# EasyEDA schematic SCH_mysplitkeyboard-left(main).json
TITLE: Sheet_1; REV: 1.0; Date: 2022-05-28; Sheet: 1/1; Drawn By: 10yeechern; Company: Your Company
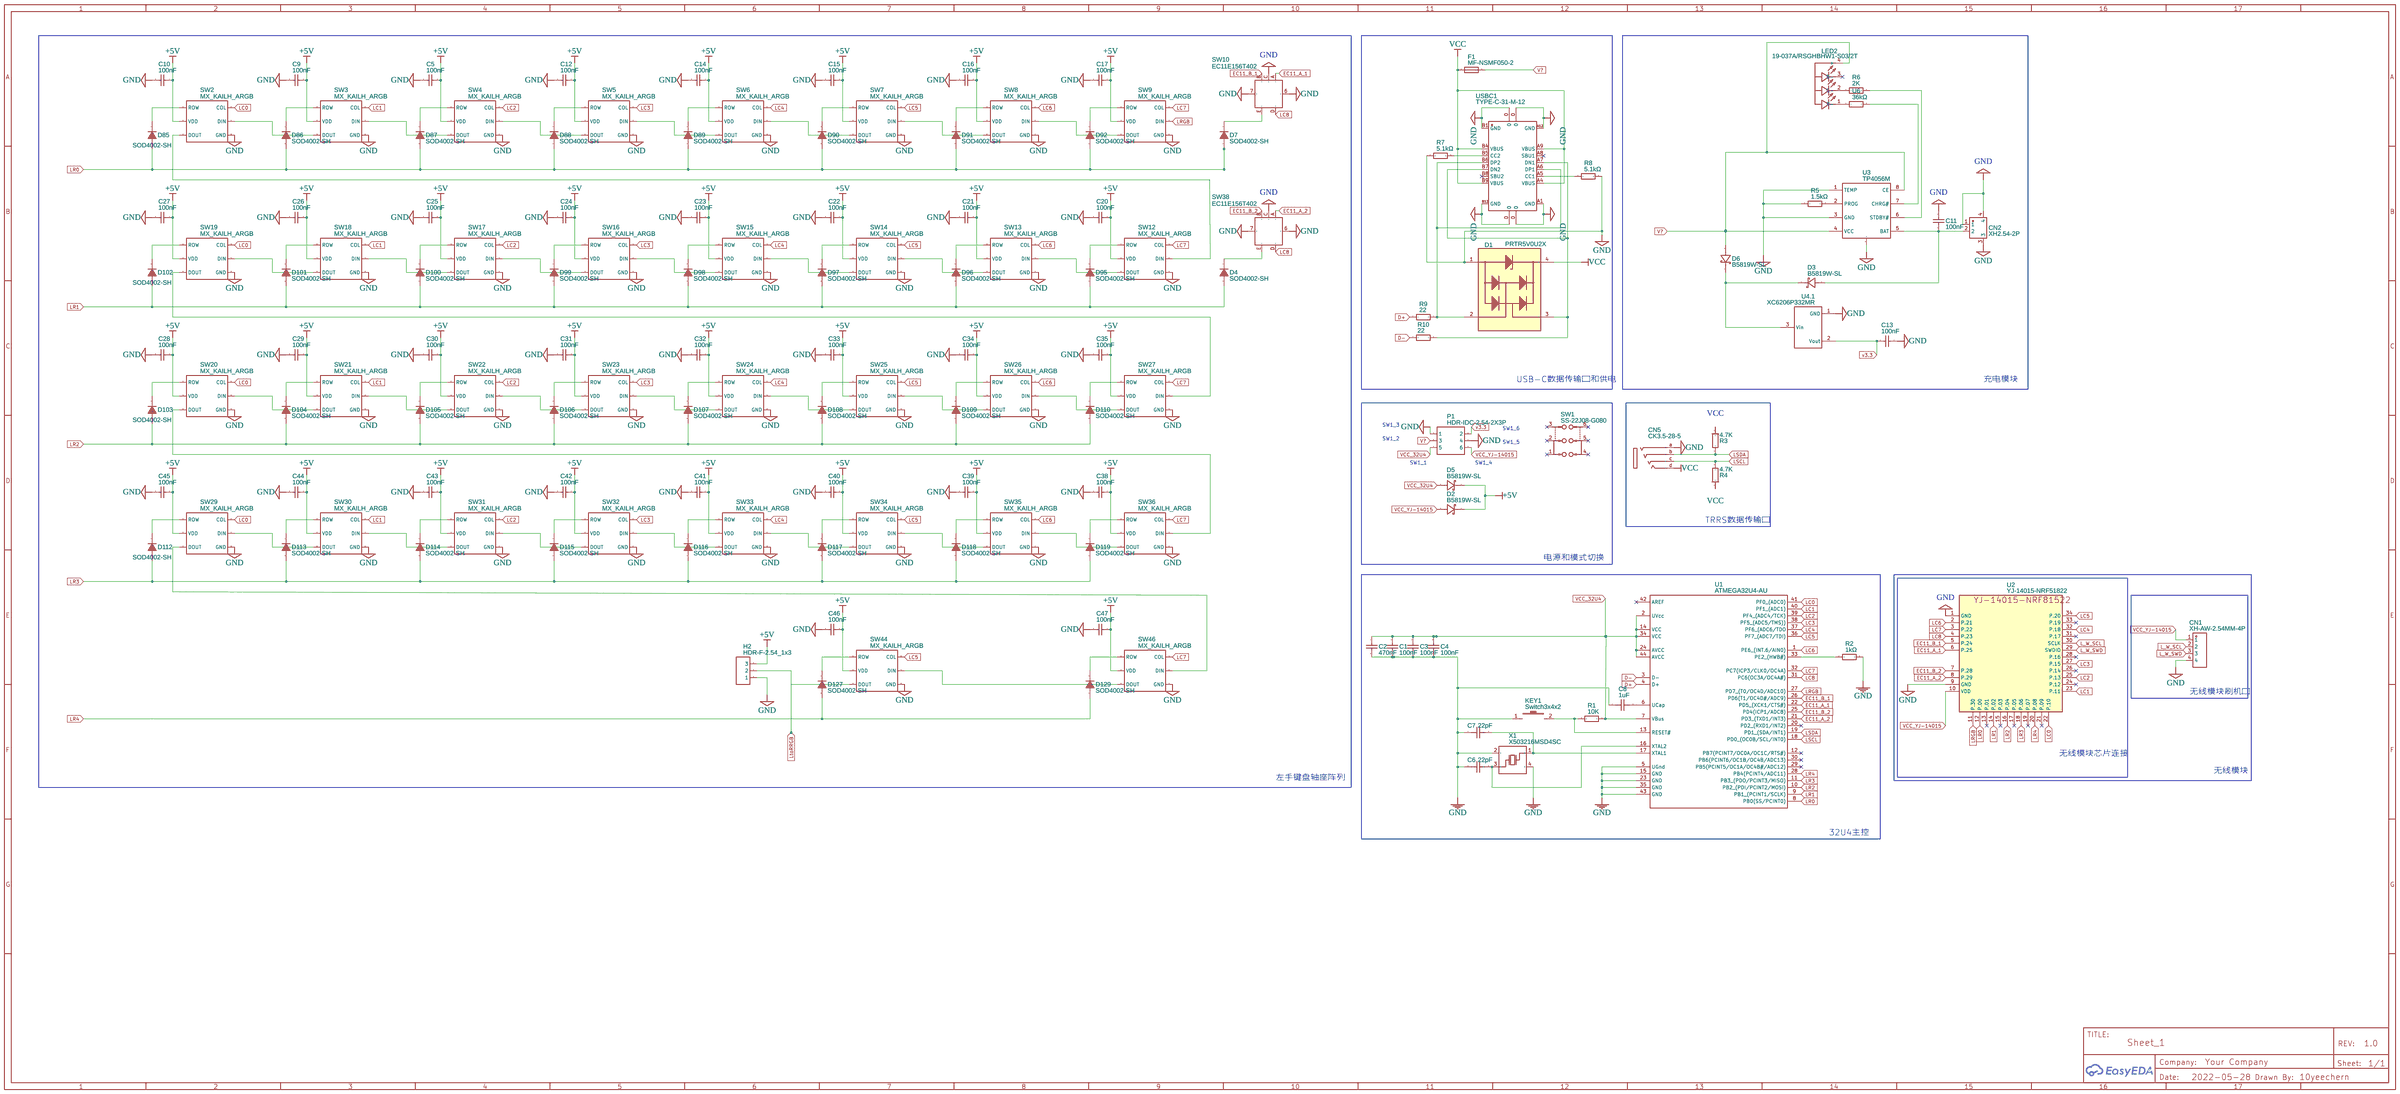
[diagram p0: schematic sheet]

## Parts
C1  100nF  [C0805]
C2  470nF  [C0805]
C3  100nF  [C0805]
C4  100nF  [C0805]
C5  100nF  [C0805]
C6  22pF  [C0805]
C7  22pF  [C0805]
C8  1uF  [C0805]
C9  100nF  [C0805]
C10  100nF  [C0805]
C11  100nF  [C0805]
C12  100nF  [C0805]
C13  100nF  [C0805]
C14  100nF  [C0805]
C15  100nF  [C0805]
C16  100nF  [C0805]
C17  100nF  [C0805]
C20  100nF  [C0805]
C21  100nF  [C0805]
C22  100nF  [C0805]
C23  100nF  [C0805]
C24  100nF  [C0805]
C25  100nF  [C0805]
C26  100nF  [C0805]
C27  100nF  [C0805]
C28  100nF  [C0805]
C29  100nF  [C0805]
C30  100nF  [C0805]
C31  100nF  [C0805]
C32  100nF  [C0805]
C33  100nF  [C0805]
C34  100nF  [C0805]
C35  100nF  [C0805]
C38  100nF  [C0805]
C39  100nF  [C0805]
C40  100nF  [C0805]
C41  100nF  [C0805]
C42  100nF  [C0805]
C43  100nF  [C0805]
C44  100nF  [C0805]
C45  100nF  [C0805]
C46  100nF  [C0805]
C47  100nF  [C0805]
CN1  XH-AW-2.54MM-4P  [CONN-TH_4P-P2.54_XH-AW-2.54MM-4P]
CN2  XH2.54-2P  [CONN-SMD_2P-P2.50-WT]
CN5  CK3.5-28-5  [AUDIO-TH_CK3.5-28-5]
D1  PRTR5V0U2X  [SOT-143_L2.9-W1.3-P1.92-LS2.3-BL]
D2  B5819W-SL  [SOD-123_L2.8-W1.8-LS3.7-RD]
D3  B5819W-SL  [SOD-123_L2.8-W1.8-LS3.7-RD]
D4  SOD4002-SH  [SOD-123F_L2.8-W1.8-LS3.7-RD]
D5  B5819W-SL  [SOD-123_L2.8-W1.8-LS3.7-RD]
D6  B5819W-SL  [SOD-123_L2.8-W1.8-LS3.7-RD]
D7  SOD4002-SH  [SOD-123F_L2.8-W1.8-LS3.7-RD]
D85  SOD4002-SH  [SOD-123F_L2.8-W1.8-LS3.7-RD]
D86  SOD4002-SH  [SOD-123F_L2.8-W1.8-LS3.7-RD]
D87  SOD4002-SH  [SOD-123F_L2.8-W1.8-LS3.7-RD]
D88  SOD4002-SH  [SOD-123F_L2.8-W1.8-LS3.7-RD]
D89  SOD4002-SH  [SOD-123F_L2.8-W1.8-LS3.7-RD]
D90  SOD4002-SH  [SOD-123F_L2.8-W1.8-LS3.7-RD]
D91  SOD4002-SH  [SOD-123F_L2.8-W1.8-LS3.7-RD]
D92  SOD4002-SH  [SOD-123F_L2.8-W1.8-LS3.7-RD]
D95  SOD4002-SH  [SOD-123F_L2.8-W1.8-LS3.7-RD]
D96  SOD4002-SH  [SOD-123F_L2.8-W1.8-LS3.7-RD]
D97  SOD4002-SH  [SOD-123F_L2.8-W1.8-LS3.7-RD]
D98  SOD4002-SH  [SOD-123F_L2.8-W1.8-LS3.7-RD]
D99  SOD4002-SH  [SOD-123F_L2.8-W1.8-LS3.7-RD]
D100  SOD4002-SH  [SOD-123F_L2.8-W1.8-LS3.7-RD]
D101  SOD4002-SH  [SOD-123F_L2.8-W1.8-LS3.7-RD]
D102  SOD4002-SH  [SOD-123F_L2.8-W1.8-LS3.7-RD]
D103  SOD4002-SH  [SOD-123F_L2.8-W1.8-LS3.7-RD]
D104  SOD4002-SH  [SOD-123F_L2.8-W1.8-LS3.7-RD]
D105  SOD4002-SH  [SOD-123F_L2.8-W1.8-LS3.7-RD]
D106  SOD4002-SH  [SOD-123F_L2.8-W1.8-LS3.7-RD]
D107  SOD4002-SH  [SOD-123F_L2.8-W1.8-LS3.7-RD]
D108  SOD4002-SH  [SOD-123F_L2.8-W1.8-LS3.7-RD]
D109  SOD4002-SH  [SOD-123F_L2.8-W1.8-LS3.7-RD]
D110  SOD4002-SH  [SOD-123F_L2.8-W1.8-LS3.7-RD]
D112  SOD4002-SH  [SOD-123F_L2.8-W1.8-LS3.7-RD]
D113  SOD4002-SH  [SOD-123F_L2.8-W1.8-LS3.7-RD]
D114  SOD4002-SH  [SOD-123F_L2.8-W1.8-LS3.7-RD]
D115  SOD4002-SH  [SOD-123F_L2.8-W1.8-LS3.7-RD]
D116  SOD4002-SH  [SOD-123F_L2.8-W1.8-LS3.7-RD]
D117  SOD4002-SH  [SOD-123F_L2.8-W1.8-LS3.7-RD]
D118  SOD4002-SH  [SOD-123F_L2.8-W1.8-LS3.7-RD]
D119  SOD4002-SH  [SOD-123F_L2.8-W1.8-LS3.7-RD]
D127  SOD4002-SH  [SOD-123F_L2.8-W1.8-LS3.7-RD]
D129  SOD4002-SH  [SOD-123F_L2.8-W1.8-LS3.7-RD]
F1  MF-NSMF050-2  [F1206]
H2  HDR-F-2.54_1x3  [HDR-F-2.54_1X3]
KEY1  Switch3x4x2  [SW-SMD_L4.0-W2.9-LS5.0]
LED2  19-037A/RSGHBHW1-S03/2T  [LED-ARRAY-SMD_4P-L1.6-W1.6-TR_EVERLIGHT_RSGHBHW1-S03]
P1  HDR-IDC-2.54-2X3P  [IDC-TH_6P-P2.54_C11214]
R1  10K  [R0805]
R2  1kΩ  [R0805]
R3  4.7K  [RES-TH_BD2.3-L6.5-P10.50-D0.5]
R4  4.7K  [RES-TH_BD2.3-L6.5-P10.50-D0.5]
R5  1.5kΩ  [R0805]
R6  2K  [R0805]
R7  5.1kΩ  [R0805]
R8  5.1kΩ  [R0805]
R9  22  [R0805]
R10  22  [R0805]
SW1  SS-22J08-G080  [SW-TH_G-SWITCH_SS-22J08-G080]
SW2  MX_KAILH_ARGB  [MX_KAILH_ARGB_V1]
SW3  MX_KAILH_ARGB  [MX_KAILH_ARGB_V1]
SW4  MX_KAILH_ARGB  [MX_KAILH_ARGB_V1]
SW5  MX_KAILH_ARGB  [MX_KAILH_ARGB_V1]
SW6  MX_KAILH_ARGB  [MX_KAILH_ARGB_V1]
SW7  MX_KAILH_ARGB  [MX_KAILH_ARGB_V1]
SW8  MX_KAILH_ARGB  [MX_KAILH_ARGB_V1]
SW9  MX_KAILH_ARGB  [MX_KAILH_ARGB_V1]
SW10  EC11E156T402  [SW-TH_EC11E156T402]
SW12  MX_KAILH_ARGB  [MX_KAILH_ARGB_V1]
SW13  MX_KAILH_ARGB  [MX_KAILH_ARGB_V1]
SW14  MX_KAILH_ARGB  [MX_KAILH_ARGB_V1]
SW15  MX_KAILH_ARGB  [MX_KAILH_ARGB_V1]
SW16  MX_KAILH_ARGB  [MX_KAILH_ARGB_V1]
SW17  MX_KAILH_ARGB  [MX_KAILH_ARGB_V1]
SW18  MX_KAILH_ARGB  [MX_KAILH_ARGB_V1]
SW19  MX_KAILH_ARGB  [MX_KAILH_ARGB_V1]
SW20  MX_KAILH_ARGB  [MX_KAILH_ARGB_V1]
SW21  MX_KAILH_ARGB  [MX_KAILH_ARGB_V1]
SW22  MX_KAILH_ARGB  [MX_KAILH_ARGB_V1]
SW23  MX_KAILH_ARGB  [MX_KAILH_ARGB_V1]
SW24  MX_KAILH_ARGB  [MX_KAILH_ARGB_V1]
SW25  MX_KAILH_ARGB  [MX_KAILH_ARGB_V1]
SW26  MX_KAILH_ARGB  [MX_KAILH_ARGB_V1]
SW27  MX_KAILH_ARGB  [MX_KAILH_ARGB_V1]
SW29  MX_KAILH_ARGB  [MX_KAILH_ARGB_V1]
SW30  MX_KAILH_ARGB  [MX_KAILH_ARGB_V1]
SW31  MX_KAILH_ARGB  [MX_KAILH_ARGB_V1]
SW32  MX_KAILH_ARGB  [MX_KAILH_ARGB_V1]
SW33  MX_KAILH_ARGB  [MX_KAILH_ARGB_V1]
SW34  MX_KAILH_ARGB  [MX_KAILH_ARGB_V1]
SW35  MX_KAILH_ARGB  [MX_KAILH_ARGB_V1]
SW36  MX_KAILH_ARGB  [MX_KAILH_ARGB_V1]
SW38  EC11E156T402  [SW-TH_EC11E156T402]
SW44  MX_KAILH_ARGB  [MX_KAILH_ARGB_V1]
SW46  MX_KAILH_ARGB  [MX_KAILH_ARGB_V1]
U1  ATMEGA32U4-AU  [QFP-44_L10.0-W10.0-P0.80-LS13.2-BL]
U2  YJ-14015-NRF51822  [YJ-14015-NRF51822]
U3  TP4056M  [MSOP-8_L3.0-W3.0-P0.65-LS5.0-BL-EP]
U4  XC6206P332MR  [SOT-23-3_L2.9-W1.6-P1.90-LS2.8-BR]  (section 1)
U6  36kΩ  [R0805]
USBC1  TYPE-C-31-M-12  [USB-C_SMD-TYPE-C-31-M-12]
X1  X503216MSD4SC  [OSC-SMD_4P-L5.0-W3.2-BL]

## Library data of the parts
C1 C3-C5 C9-C17 C20-C35 C38-C47 = C0805C104K5RACAUTO: Supplier: LCSC; Manufacturer: KEMET; Contributor: LCSC; Supplier Part: C129641; JLCPCB Part Class: Extended Part
C2 = 0805B474K500NT: Supplier: LCSC; Manufacturer: FH; Supplier Part: C49955; JLCPCB Part Class: Extended Part
C6 C7 = CC0805GRNPO9BN220: Supplier: LCSC; Supplier Part: C520058; Manufacturer: YAGEO; Contributor: LCSC; JLCPCB Part Class: Extended Part
C8 = CC0805MRY5V7BB105: Supplier: LCSC; Supplier Part: C520017; Manufacturer: YAGEO; Contributor: LCSC; JLCPCB Part Class: Extended Part
CN1 = XH-AW-2.54MM-4P: Supplier: LCSC; Supplier Part: C9900018797; Manufacturer: null; JLCPCB Part Class: Extended Part; Contributor: lcsc
CN2 = XH2.54-2P: Supplier: LCSC; Supplier Part: C9900004348; Manufacturer: 深圳华利; link: https://item.taobao.com/item.htm?id=584598398852&price=0.1-0.18&sourceType=item&detailSharePosition=interactBar&sourceType=item&suid=31843e8f-a3cd-4e51-8449-826e7ea887a9&shareUniqueId=14191166517&ut_s; Contributor: LCSC; JLCPCB Part Class: Extended Part
CN5 = CK3.5-28-5: Supplier: LCSC; Supplier Part: C718048; Manufacturer: JINJIA; Contributor: LCSC; JLCPCB Part Class: Extended Part
D1 = PRTR5V0U2X: Supplier: LCSC; Supplier Part: C330092; Manufacturer: Yenji Elec; Contributor: LCSC
D2 D3 D5 D6 = B5819W-SL: Supplier: LCSC; Supplier Part: C779676; Manufacturer: ZRE; Contributor: LCSC; JLCPCB Part Class: Extended Part
D4 D7 D85-D92 D95-D110 D112-D119 D127 D129 = SOD4002-SH: Supplier: LCSC; Manufacturer: LRC; Contributor: LCSC; Supplier Part: C154996; JLCPCB Part Class: Extended Part
F1 = MF-NSMF050-2: Supplier: LCSC; Manufacturer: BOURNS; Supplier Part: C75464; JLCPCB Part Class: Extended Part
H2 = HDR-F-2.54_1x3: Supplier Part: C146690; Supplier: LCSC; Contributor: LCEDA_Lib
KEY1 = Switch3x4x2: Supplier: LCSC; Manufacturer: ReliaPro; Supplier Part: C26638; JLCPCB Part Class: Extended Part
LED2 = 19-037A/RSGHBHW1-S03/2T: Supplier: LCSC; Supplier Part: C282128; Manufacturer: Everlight Elec; Contributor: LCSC; JLCPCB Part Class: Extended Part
P1 = HDR-IDC-2.54-2X3P: Supplier: LCSC; Manufacturer: BOOMELE; Manufacturer Part: 2X3 2.54mm IDC Box; image: //image.lceda.cn/szlcsc/C11214.jpg; Supplier Part: C11214
R1 = RC0805FR-0710KL: Supplier: LCSC; Manufacturer: YAGEO; Supplier Part: C84376; JLCPCB Part Class: Extended Part; Resistance: 10kΩ
R2 = CR0805F81001G: Supplier: LCSC; Manufacturer: LIZ; Supplier Part: C101404; Resistance (Ohms): 1K; JLCPCB Part Class: Extended Part
R3 R4 = MF1/4W-4.7KΩ±1% T52: Supplier: LCSC; Supplier Part: C119339; Manufacturer: Chian Chia Elec; Contributor: LCSC; JLCPCB Part Class: Extended Part; Resistance: 4.7kΩ
R5 = RMC08051.5K1%N: Supplier: LCSC; Supplier Part: C269739; Manufacturer: Tyohm; Resistance (Ohms): 1.5K; Contributor: LCSC; JLCPCB Part Class: Extended Part
R6 = CR0805-FX-2001ELF: Supplier: LCSC; Supplier Part: C203834; Manufacturer: BOURNS; Contributor: LCSC; JLCPCB Part Class: Extended Part; Resistance: 2kΩ
R7 R8 = AECR0805F5K10K9: Supplier: LCSC; Supplier Part: C328405; Manufacturer: ResistorToday; Resistance (Ohms): 5.1K; Contributor: LCSC; JLCPCB Part Class: Extended Part
R9 R10 = RC0805FR-0722RL: Supplier: LCSC; Manufacturer: YAGEO; Supplier Part: C107702; JLCPCB Part Class: Extended Part; Resistance: 22Ω
SW1 = SS-22J08-G080: Supplier: LCSC; Supplier Part: C2848898; Manufacturer: G-Switch(品赞); Contributor: LCSC
SW2-SW9 SW12-SW27 SW29-SW36 SW44 SW46 = MX_KAILH_ARGB_REVERSABLE: Contributor: Dusty Kuban
SW10 SW38 = EC11E156T402: Supplier: LCSC; Supplier Part: C2687292; Manufacturer: ALPSALPINE(阿尔卑斯阿尔派); Contributor: LCSC; JLCPCB Part Class: Extended Part
U1 = ATMEGA32U4-AU: Supplier: LCSC; Manufacturer: MICROCHIP; Supplier Part: C44854; JLCPCB Part Class: Extended Part
U2 = YJ-14015-NRF51822: Supplier: AliExpress; Contributor: slorenm
U3 = TP4056M: Supplier: LCSC; Manufacturer: TOPPOWER; Supplier Part: C21417; JLCPCB Part Class: Extended Part
U4 = XC6206P332MR: Supplier: LCSC; Manufacturer: TOREX; Supplier Part: C5446; JLCPCB Part Class: Basic Part; subpart_no: 1
U6 = HPCR0805F36K0K9: Supplier: LCSC; Supplier Part: C365294; Manufacturer: ResistorToday; Resistance (Ohms): 36K; Contributor: LCSC; JLCPCB Part Class: Extended Part
USBC1 = TYPE-C-31-M-12: Supplier: LCSC; Supplier Part: C165948; Manufacturer: Rectangular Connectors - Contacts; Contributor: LCSC; JLCPCB Part Class: Extended Part
X1 = X503216MSD4SC: Supplier Part: C70680; Supplier: LCSC; Manufacturer: YXC

## Nets
+5V: C5.1 C9.1 C10.1 C12.1 C14.1 C15.1 C16.1 C17.1 C20.1 C21.1 C22.1 C23.1 C24.1 C25.1 C26.1 C27.1 C28.1 C29.1 C30.1 C31.1 C32.1 C33.1 C34.1 C35.1 C38.1 C39.1 C40.1 C41.1 C42.1 C43.1 C44.1 C45.1 C46.1 C47.1 D2.1(C) D5.1(C) H2.3 SW2.VDD SW3.VDD SW4.VDD SW5.VDD SW6.VDD SW7.VDD SW8.VDD SW9.VDD SW12.VDD SW13.VDD SW14.VDD SW15.VDD SW16.VDD SW17.VDD SW18.VDD SW19.VDD SW20.VDD SW21.VDD SW22.VDD SW23.VDD SW24.VDD SW25.VDD SW26.VDD SW27.VDD SW29.VDD SW30.VDD SW31.VDD SW32.VDD SW33.VDD SW34.VDD SW35.VDD SW36.VDD SW44.VDD SW46.VDD
GND: C1.1 C2.2 C3.1 C4.1 C5.2 C6.1 C7.1 C8.1 C9.2 C10.2 C11.2 C12.2 C13.2 C14.2 C15.2 C16.2 C17.2 C20.2 C21.2 C22.2 C23.2 C24.2 C25.2 C26.2 C27.2 C28.2 C29.2 C30.2 C31.2 C32.2 C33.2 C34.2 C35.2 C38.2 C39.2 C40.2 C41.2 C42.2 C43.2 C44.2 C45.2 C46.2 C47.2 CN1.4 CN2.1 CN2.3 CN2.4 CN5.a D1.1(GND) H2.1 KEY1.1 P1.1 P1.4 R2.2 R5.1 R7.1 R8.2 SW2.GND SW3.GND SW4.GND SW5.GND SW6.GND SW7.GND SW8.GND SW9.GND SW10.6(EH) SW10.7(EH) SW10.C SW12.GND SW13.GND SW14.GND SW15.GND SW16.GND SW17.GND SW18.GND SW19.GND SW20.GND SW21.GND SW22.GND SW23.GND SW24.GND SW25.GND SW26.GND SW27.GND SW29.GND SW30.GND SW31.GND SW32.GND SW33.GND SW34.GND SW35.GND SW36.GND SW38.6(EH) SW38.7(EH) SW38.C SW44.GND SW46.GND U1.5(UGnd) U1.15(GND) U1.23(GND) U1.35(GND) U1.43(GND) U2.1(GND) U2.9(GND) U3.1(TEMP) U3.3(GND) U3.9 U4.1(GND) USBC1.0 USBC1.A1(GND) USBC1.A12(GND) USBC1.B1(GND) USBC1.B12(GND) X1.2(GND) X1.4(GND)
v3.3: C13.1 P1.2 U4.2(Vout)
VCC: CN5.d D1.4(VCC) F1.1 R3.2 R4.2 USBC1.A4(VBUS) USBC1.A9(VBUS) USBC1.B4(VBUS) USBC1.B9(VBUS)
VCC_32U4: C1.2 C2.1 C3.2 C4.2 D5.2(A) P1.5 R1.1 U1.2(UVcc) U1.7(VBus) U1.14(VCC) U1.24(AVCC) U1.34(VCC) U1.44(AVCC)
VCC_YJ-14015: CN1.1 D2.2(A) P1.6 U2.10(VDD)
D+: R9.2 U1.4(D+)
D-: R10.2 U1.3(D-)
EC11_A_1: SW10.A U1.22(PD5 (XCK1/CTS#)) U2.6(P.25)
EC11_A_2: SW38.A U1.21(PD3 (TXD1/INT3)) U2.8(P.29)
EC11_B_1: SW10.B U1.26(PD6(T1/OC4D#/ADC9)) U2.5(P.24)
EC11_B_2: SW38.B U1.25(PD4(ICP1/ADC8)) U2.7(P.28)
L_W_SCL: CN1.2 U2.30(SCLK)
L_W_SWD: CN1.3 U2.29(SWDIO)
LC0: SW2.COL SW19.COL SW20.COL SW29.COL U1.41(PF0 (ADC0)) U2.22(P.10)
LC1: SW3.COL SW18.COL SW21.COL SW30.COL U1.40(PF1 (ADC1)) U2.23(P.11)
LC2: SW4.COL SW17.COL SW22.COL SW31.COL U1.39(PF4 (ADC4/TCK)) U2.25(P.13)
LC3: SW5.COL SW16.COL SW23.COL SW32.COL U1.38(PF5 (ADC5/TMS))) U2.27(P.15)
LC4: SW6.COL SW15.COL SW24.COL SW33.COL U1.37(PF6 (ADC6/TDO) U2.32(P.18)
LC5: SW7.COL SW14.COL SW25.COL SW34.COL SW44.COL U1.36(PF7 (ADC7/TDI)) U2.34(P.20)
LC6: SW8.COL SW13.COL SW26.COL SW35.COL U1.1(PE6 (INT.6/AIN0)) U2.2(P.21)
LC7: SW9.COL SW12.COL SW27.COL SW36.COL SW46.COL U1.32(PC7(ICP3/CLK0/OC4A)) U2.3(P.22)
LC8: SW10.D SW38.D U1.31(PC6(OC3A/OC4A#)) U2.4(P.23)
LR0: D7.2(A) D85.2(A) D86.2(A) D87.2(A) D88.2(A) D89.2(A) D90.2(A) D91.2(A) D92.2(A) U1.8(PB0(SS/PCINT0)) U2.12(P.00)
LR1: D4.2(A) D95.2(A) D96.2(A) D97.2(A) D98.2(A) D99.2(A) D100.2(A) D101.2(A) D102.2(A) U1.9(PB1 (PCINT1/SCLK)) U2.14(P.02)
LR2: D103.2(A) D104.2(A) D105.2(A) D106.2(A) D107.2(A) D108.2(A) D109.2(A) D110.2(A) U1.10(PB2 (PDI/PCINT2/MOSI)) U2.16(P.04)
LR3: D112.2(A) D113.2(A) D114.2(A) D115.2(A) D116.2(A) D117.2(A) D118.2(A) D119.2(A) U1.11(PB3 (PDO/PCINT3/MISO)) U2.18(P.06)
LR4: D127.2(A) D129.2(A) U1.28(PB4(PCINT4/ADC11)) U2.20(P.08)
LRGB: SW9.DIN U1.27(PD7 (T0/OC4D/ADC10)) U2.11(P.30)
LSCL: CN5.c R4.1 U1.18(PD0 (OC0B/SCL/INT0))
LSDA: CN5.b R3.1 U1.19(PD1 (SDA/INT1))
LtoRRGB: H2.2 SW44.DOUT
V?: D6.2(A) F1.2 LED2.4(+) P1.3 U3.4(VCC) U3.8(CE)
Net-(C6-2): C6.2 U1.16(XTAL2) X1.3(OSC2)
Net-(C7-2): C7.2 U1.17(XTAL1) X1.1(OSC1)
Net-(C8-2): C8.2 U1.6(UCap)
Net-(C11-1): C11.1 CN2.2 D3.2(A) U3.5(BAT)
Net-(D1-2): D1.2(IO1) R9.1 USBC1.A6(DP1) USBC1.B6(DP2)
Net-(D1-3): D1.3(IO2) R10.1 USBC1.A7(DN1) USBC1.B7(DN2)
Net-(D3-1): D3.1(C) D6.1(C) U4.3(Vin)
Net-(D4-1): D4.1(K) SW38.E
Net-(D7-1): D7.1(K) SW10.E
Net-(D85-1): D85.1(K) SW2.ROW
Net-(D86-1): D86.1(K) SW3.ROW
Net-(D87-1): D87.1(K) SW4.ROW
Net-(D88-1): D88.1(K) SW5.ROW
Net-(D89-1): D89.1(K) SW6.ROW
Net-(D90-1): D90.1(K) SW7.ROW
Net-(D91-1): D91.1(K) SW8.ROW
Net-(D92-1): D92.1(K) SW9.ROW
Net-(D95-1): D95.1(K) SW12.ROW
Net-(D96-1): D96.1(K) SW13.ROW
Net-(D97-1): D97.1(K) SW14.ROW
Net-(D98-1): D98.1(K) SW15.ROW
Net-(D99-1): D99.1(K) SW16.ROW
Net-(D100-1): D100.1(K) SW17.ROW
Net-(D101-1): D101.1(K) SW18.ROW
Net-(D102-1): D102.1(K) SW19.ROW
Net-(D103-1): D103.1(K) SW20.ROW
Net-(D104-1): D104.1(K) SW21.ROW
Net-(D105-1): D105.1(K) SW22.ROW
Net-(D106-1): D106.1(K) SW23.ROW
Net-(D107-1): D107.1(K) SW24.ROW
Net-(D108-1): D108.1(K) SW25.ROW
Net-(D109-1): D109.1(K) SW26.ROW
Net-(D110-1): D110.1(K) SW27.ROW
Net-(D112-1): D112.1(K) SW29.ROW
Net-(D113-1): D113.1(K) SW30.ROW
Net-(D114-1): D114.1(K) SW31.ROW
Net-(D115-1): D115.1(K) SW32.ROW
Net-(D116-1): D116.1(K) SW33.ROW
Net-(D117-1): D117.1(K) SW34.ROW
Net-(D118-1): D118.1(K) SW35.ROW
Net-(D119-1): D119.1(K) SW36.ROW
Net-(D127-1): D127.1(K) SW44.ROW
Net-(D129-1): D129.1(K) SW46.ROW
Net-(KEY1-2): KEY1.2 R1.2 U1.13(RESET#)
Net-(LED2-1): LED2.1(R-) U6.1
Net-(LED2-2): LED2.2(G-) R6.1
Net-(R2-1): R2.1 U1.33(PE2 (HWB#))
Net-(R5-2): R5.2 U3.2(PROG)
Net-(R6-2): R6.2 U3.6(STDBY#)
Net-(R7-2): R7.2 USBC1.B5(CC2)
Net-(R8-1): R8.1 USBC1.A5(CC1)
Net-(SW2-DIN): SW2.DIN SW3.DOUT
Net-(SW2-DOUT): SW2.DOUT SW12.DIN
Net-(SW3-DIN): SW3.DIN SW4.DOUT
Net-(SW4-DIN): SW4.DIN SW5.DOUT
Net-(SW5-DIN): SW5.DIN SW6.DOUT
Net-(SW6-DIN): SW6.DIN SW7.DOUT
Net-(SW7-DIN): SW7.DIN SW8.DOUT
Net-(SW8-DIN): SW8.DIN SW9.DOUT
Net-(SW12-DOUT): SW12.DOUT SW13.DIN
Net-(SW13-DOUT): SW13.DOUT SW14.DIN
Net-(SW14-DOUT): SW14.DOUT SW15.DIN
Net-(SW15-DOUT): SW15.DOUT SW16.DIN
Net-(SW16-DOUT): SW16.DOUT SW17.DIN
Net-(SW17-DOUT): SW17.DOUT SW18.DIN
Net-(SW18-DOUT): SW18.DOUT SW19.DIN
Net-(SW19-DOUT): SW19.DOUT SW27.DIN
Net-(SW20-DIN): SW20.DIN SW21.DOUT
Net-(SW20-DOUT): SW20.DOUT SW36.DIN
Net-(SW21-DIN): SW21.DIN SW22.DOUT
Net-(SW22-DIN): SW22.DIN SW23.DOUT
Net-(SW23-DIN): SW23.DIN SW24.DOUT
Net-(SW24-DIN): SW24.DIN SW25.DOUT
Net-(SW25-DIN): SW25.DIN SW26.DOUT
Net-(SW26-DIN): SW26.DIN SW27.DOUT
Net-(SW29-DIN): SW29.DIN SW30.DOUT
Net-(SW29-DOUT): SW29.DOUT SW46.DIN
Net-(SW30-DIN): SW30.DIN SW31.DOUT
Net-(SW31-DIN): SW31.DIN SW32.DOUT
Net-(SW32-DIN): SW32.DIN SW33.DOUT
Net-(SW33-DIN): SW33.DIN SW34.DOUT
Net-(SW34-DIN): SW34.DIN SW35.DOUT
Net-(SW35-DIN): SW35.DIN SW36.DOUT
Net-(SW44-DIN): SW44.DIN SW46.DOUT
Net-(U3-7): U3.7(CHRG#) U6.2

Not connected (* = marked no-connect by the designer): LED2 3(B-)*; SW1 1* 2* 3* 4* 5* 6*; U1 12(PB7(PCINT7/OC0A/OC1C/RTS#))* 20(PD2 (RXD1/INT2))* 29(PB5(PCINT5/OC1A/OC4B#/ADC12))* 30(PB6(PCINT6/OC1B/OC4B/ADC13))* 42(AREF)*; U2 13(P.01)* 15(P.03)* 17(P.05)* 19(P.07)* 21(P.09)* 24(P.12)* 26(P.14)* 28(P.16)* 31(P.17)* 33(P.19)*; USBC1 A8(SBU1)* B8(SBU2)*

## Notes on the sheet
- USB-C数据传输口和供电
- 充电模块
- SW1_3
- SW1_6
- SW1_2
- SW1_5
- SW1_1
- SW1_4
- TRRS数据传输口
- 电源和模式切换
- 无线模块刷机口
- 无线模块芯片连接
- 无线模块
- 左手键盘轴座阵列
- 32U4主控
